# EAGLE design pov_display (EAGLE 6.1)
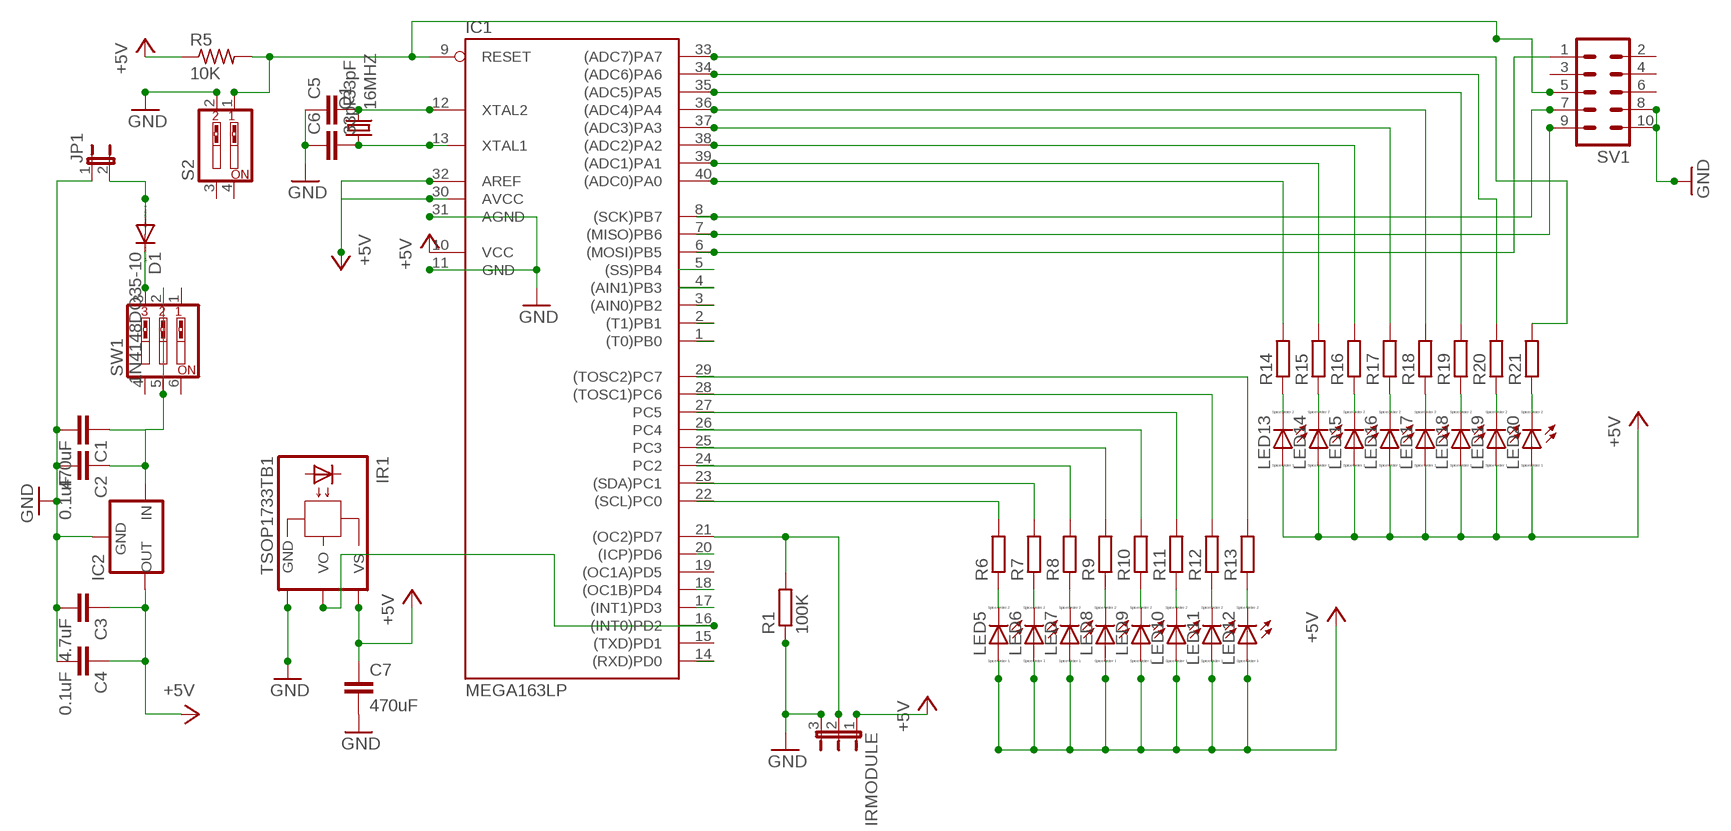
[diagram p0: schematic, sheet 1]

## Parts
C1  470uF  C2.5/4  [C2.5-4]
C2  0.1uF  C2.5/4  [C2.5-4]
C3  4.7uF  C2.5/4  [C2.5-4]
C4  0.1uF  C2.5/4  [C2.5-4]
C5  33pF  C2.5/4  [C2.5-4]
C6  33pF  C2.5/4  [C2.5-4]
C7  470uF  C2.5/4  [C2.5-4]
D1  1N4148DO35-10  [DO35-10]
IC1  MEGA163LP  [DIL40]
IC2  78XXS  [78XXS]
IR1  TSOP1733TB1  [TSOP17_TB1]
IRMODULE  JP2W  [JP2W]
JP1  JP1E  [JP1]
LED5  LED_ELD260  [LED_LD260]
LED6  LED_ELD260  [LED_LD260]
LED7  LED_ELD260  [LED_LD260]
LED8  LED_ELD260  [LED_LD260]
LED9  LED_ELD260  [LED_LD260]
LED10  LED_ELD260  [LED_LD260]
LED11  LED_ELD260  [LED_LD260]
LED12  LED_ELD260  [LED_LD260]
LED13  LED_ELD260  [LED_LD260]
LED14  LED_ELD260  [LED_LD260]
LED15  LED_ELD260  [LED_LD260]
LED16  LED_ELD260  [LED_LD260]
LED17  LED_ELD260  [LED_LD260]
LED18  LED_ELD260  [LED_LD260]
LED19  LED_ELD260  [LED_LD260]
LED20  LED_ELD260  [LED_LD260]
Q1  16MHZ  CRYSTALHC49U-V  [HC49U-V]
R1  100K  R-EU_0207/7  [0207/7]
R5  10K  R-US_0204/7  [0204/7]
R6  R-EU_0207/7  [0207/7]
R7  R-EU_0207/7  [0207/7]
R8  R-EU_0207/7  [0207/7]
R9  R-EU_0207/7  [0207/7]
R10  R-EU_0207/7  [0207/7]
R11  R-EU_0207/7  [0207/7]
R12  R-EU_0207/7  [0207/7]
R13  R-EU_0207/7  [0207/7]
R14  R-EU_0207/7  [0207/7]
R15  R-EU_0207/7  [0207/7]
R16  R-EU_0207/7  [0207/7]
R17  R-EU_0207/7  [0207/7]
R18  R-EU_0207/7  [0207/7]
R19  R-EU_0207/7  [0207/7]
R20  R-EU_0207/7  [0207/7]
R21  R-EU_0207/7  [0207/7]
S2  SW_DIP-2  [EDG-02]
SV1  MA05-2  [MA05-2]
SW1  SW_DIP-3  [EDG-03]

## Nets
+5V: C3.1 C4.1 C7.1 IC1.10(VCC) IC1.30(AVCC) IC1.32(AREF) IC2.OUT IR1.VS IRMODULE.1 LED5.A LED6.A LED7.A LED8.A LED9.A LED10.A LED11.A LED12.A LED13.A LED14.A LED15.A LED16.A LED17.A LED18.A LED19.A LED20.A R5.1
GND: C1.2 C2.2 C3.2 C4.2 C5.1 C6.1 C7.2 IC1.11(GND) IC1.31(AGND) IC2.GND IR1.GND IRMODULE.3 JP1.1 R1.1 S2.2 SV1.8 SV1.10
N$1: D1.A JP1.2
N$2: LED12.K(C) R13.1
N$3: C5.2 IC1.12(XTAL2) Q1.2
N$4: C6.2 IC1.13(XTAL1) Q1.1
N$5: IC1.20((ICP)PD6)
N$6: IC1.9(RESET) R5.2 S2.1 SV1.5
N$7: IC1.22((SCL)PC0) R6.2
N$8: D1.C SW1.3
N$9: C1.1 C2.1 IC2.IN SW1.2 SW1.5
N$10: IC1.1((T0)PB0)
N$11: IC1.2((T1)PB1)
N$12: IC1.3((AIN0)PB2)
N$13: IC1.4((AIN1)PB3)
N$14: IC1.17((INT1)PD3)
N$15: IC1.21((OC2)PD7) IRMODULE.2 R1.2
N$16: IC1.5((SS)PB4)
N$17: IC1.28((TOSC1)PC6) R12.2
N$18: LED10.K(C) R11.1
N$19: IC1.26(PC4) R10.2
N$20: LED9.K(C) R10.1
N$21: IC1.25(PC3) R9.2
N$22: LED8.K(C) R9.1
N$23: LED7.K(C) R8.1
N$24: IC1.6((MOSI)PB5) SV1.1
N$25: IC1.7((MISO)PB6) SV1.9
N$26: IC1.8((SCK)PB7) SV1.7
N$27: IC1.14((RXD)PD0)
N$28: IC1.23((SDA)PC1) R7.2
N$29: IC1.33((ADC7)PA7) R21.2
N$30: IC1.34((ADC6)PA6) R20.2
N$31: IC1.35((ADC5)PA5) R19.2
N$32: IC1.36((ADC4)PA4) R18.2
N$33: IC1.37((ADC3)PA3) R17.2
N$34: IC1.38((ADC2)PA2) R16.2
N$35: IC1.39((ADC1)PA1) R15.2
N$36: IC1.40((ADC0)PA0) R14.2
N$37: IC1.24(PC2) R8.2
N$38: IC1.27(PC5) R11.2
N$39: IC1.29((TOSC2)PC7) R13.2
N$40: LED6.K(C) R7.1
N$41: LED20.K(C) R21.1
N$42: LED19.K(C) R20.1
N$43: LED18.K(C) R19.1
N$44: LED17.K(C) R18.1
N$45: LED15.K(C) R16.1
N$46: LED13.K(C) R14.1
N$47: LED16.K(C) R17.1
N$48: LED14.K(C) R15.1
N$49: LED5.K(C) R6.1
N$50: LED11.K(C) R12.1
N$57: IC1.18((OC1B)PD4)
N$58: IC1.16((INT0)PD2) IR1.VO
Unconnected: IC1.15((TXD)PD1) IC1.19((OC1A)PD5) S2.3 S2.4 SV1.2 SV1.3 SV1.4 SV1.6 SW1.1 SW1.4 SW1.6

## Library data of the parts
C1-C7 = capacitor-wima:C: CAPACITOR naming: grid - package width
D1 = diode:1N4148: DIODE high speed (Philips)
IC1 = atmel:MEGA163*P: MICROCONTROLLER 16 Kbytes FLASH 1 Kbytes EEPROM 1 Kbytes SRAM UART 8-channel 10 bit ADC hardware multiplier Source: avr.lbr; OC_FARNELL: unknown; OC_NEWARK: unknown
IC2 = v-reg:78XXS: VOLTAGE REGULATOR
IR1 = telefunken:TSOP17*TB1: TSOP17..TB1 IR Receiver Modules for Remote Control Systems Source: http://www.vishay.com/docs/82042/82042.pdf; OC_FARNELL: unknown; OC_NEWARK: unknown
IRMODULE = jumper:JP2W: JUMPER
JP1 = jumper:JP1E: JUMPER
LED5-LED20 = eagle-ltspice:LED_E: LED Source: http://www.osram.convergy.de Source: www.luxeon.com Source: www.kingbright.com; SPICEMODEL: NONE; SPICEPREFIX: D; SPICETYPE: diode
Q1 = crystal:CRYSTAL: CRYSTAL; OC_FARNELL: 1666969; OC_NEWARK: unknown
R1 R6-R21 = rcl:R-EU_: RESISTOR, European symbol
R5 = resistor:R-US_: RESISTOR, American symbol
S2 = special:SW_DIP-2: DIP SWITCH
SV1 = con-lstb:MA05-2: PIN HEADER; OC_FARNELL: unknown; OC_NEWARK: unknown
SW1 = special:SW_DIP-3: DIP SWITCH

## Board
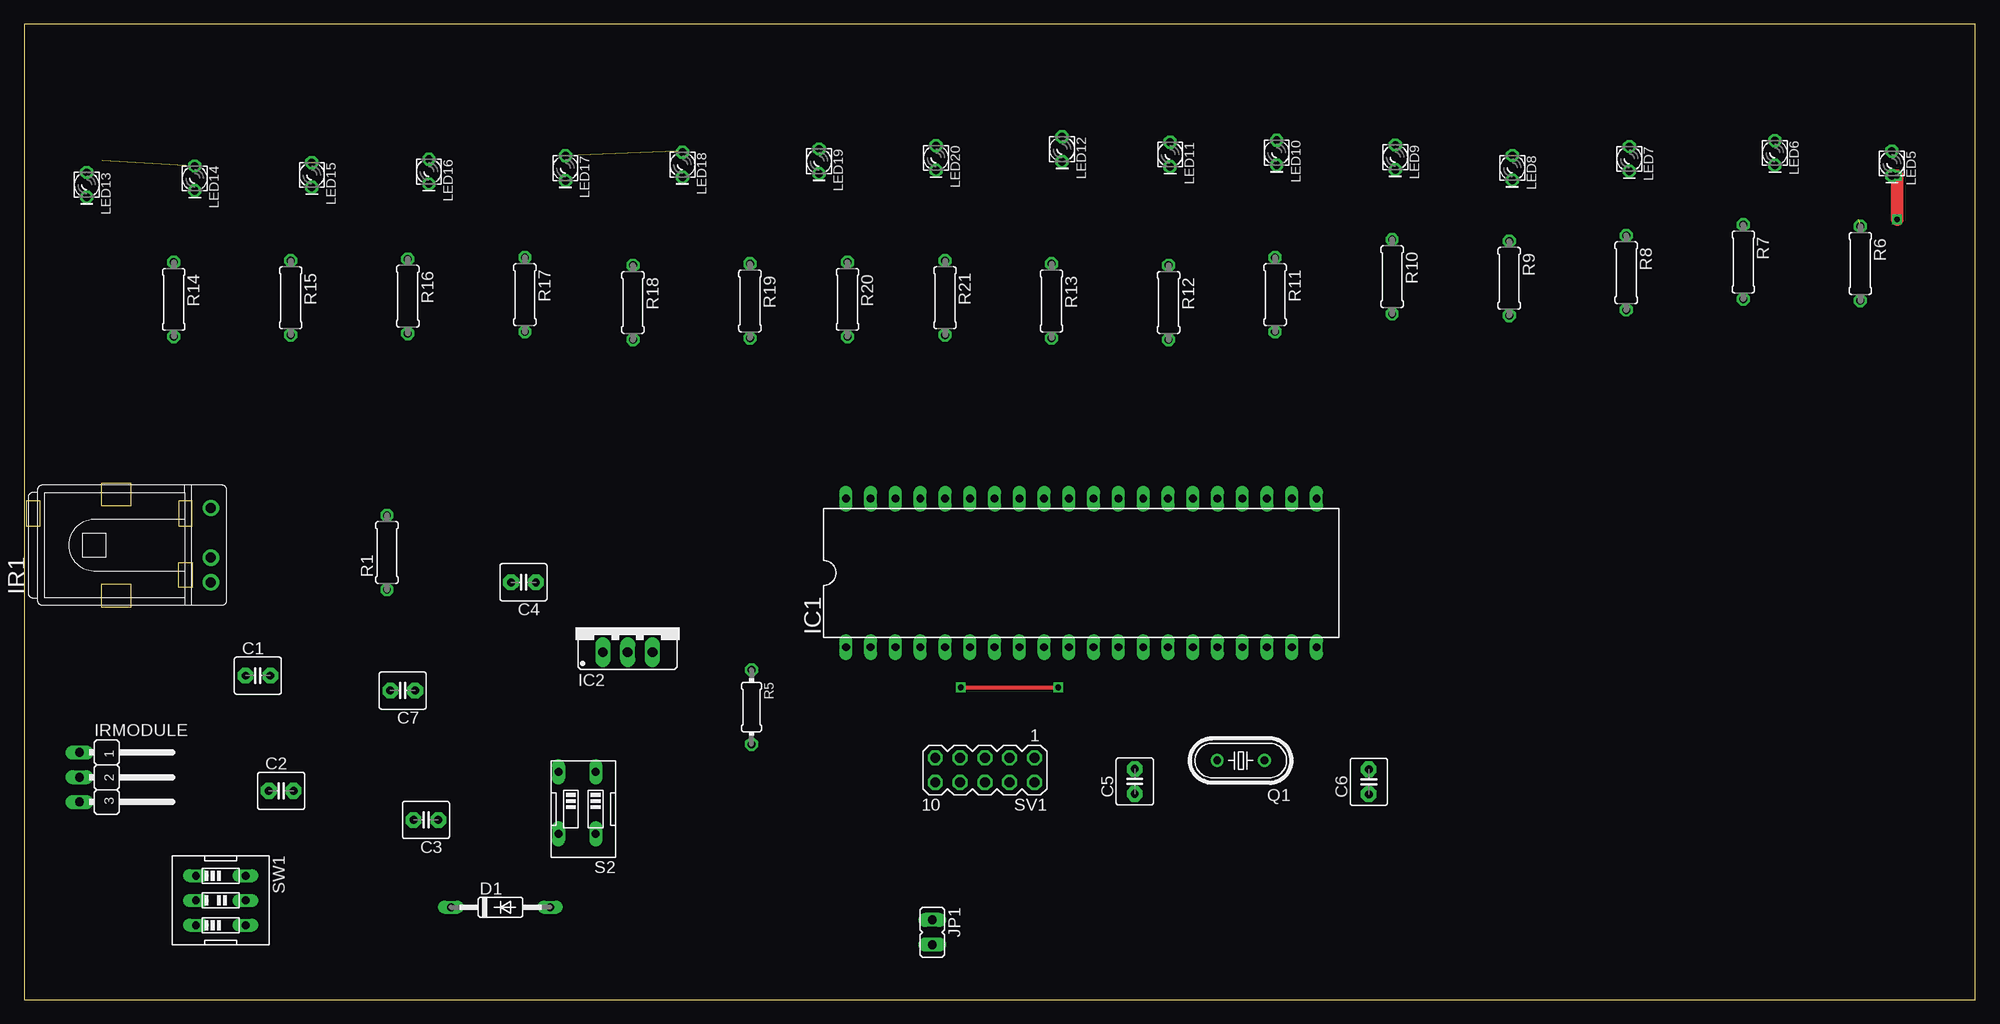
[diagram p1: board, top side]
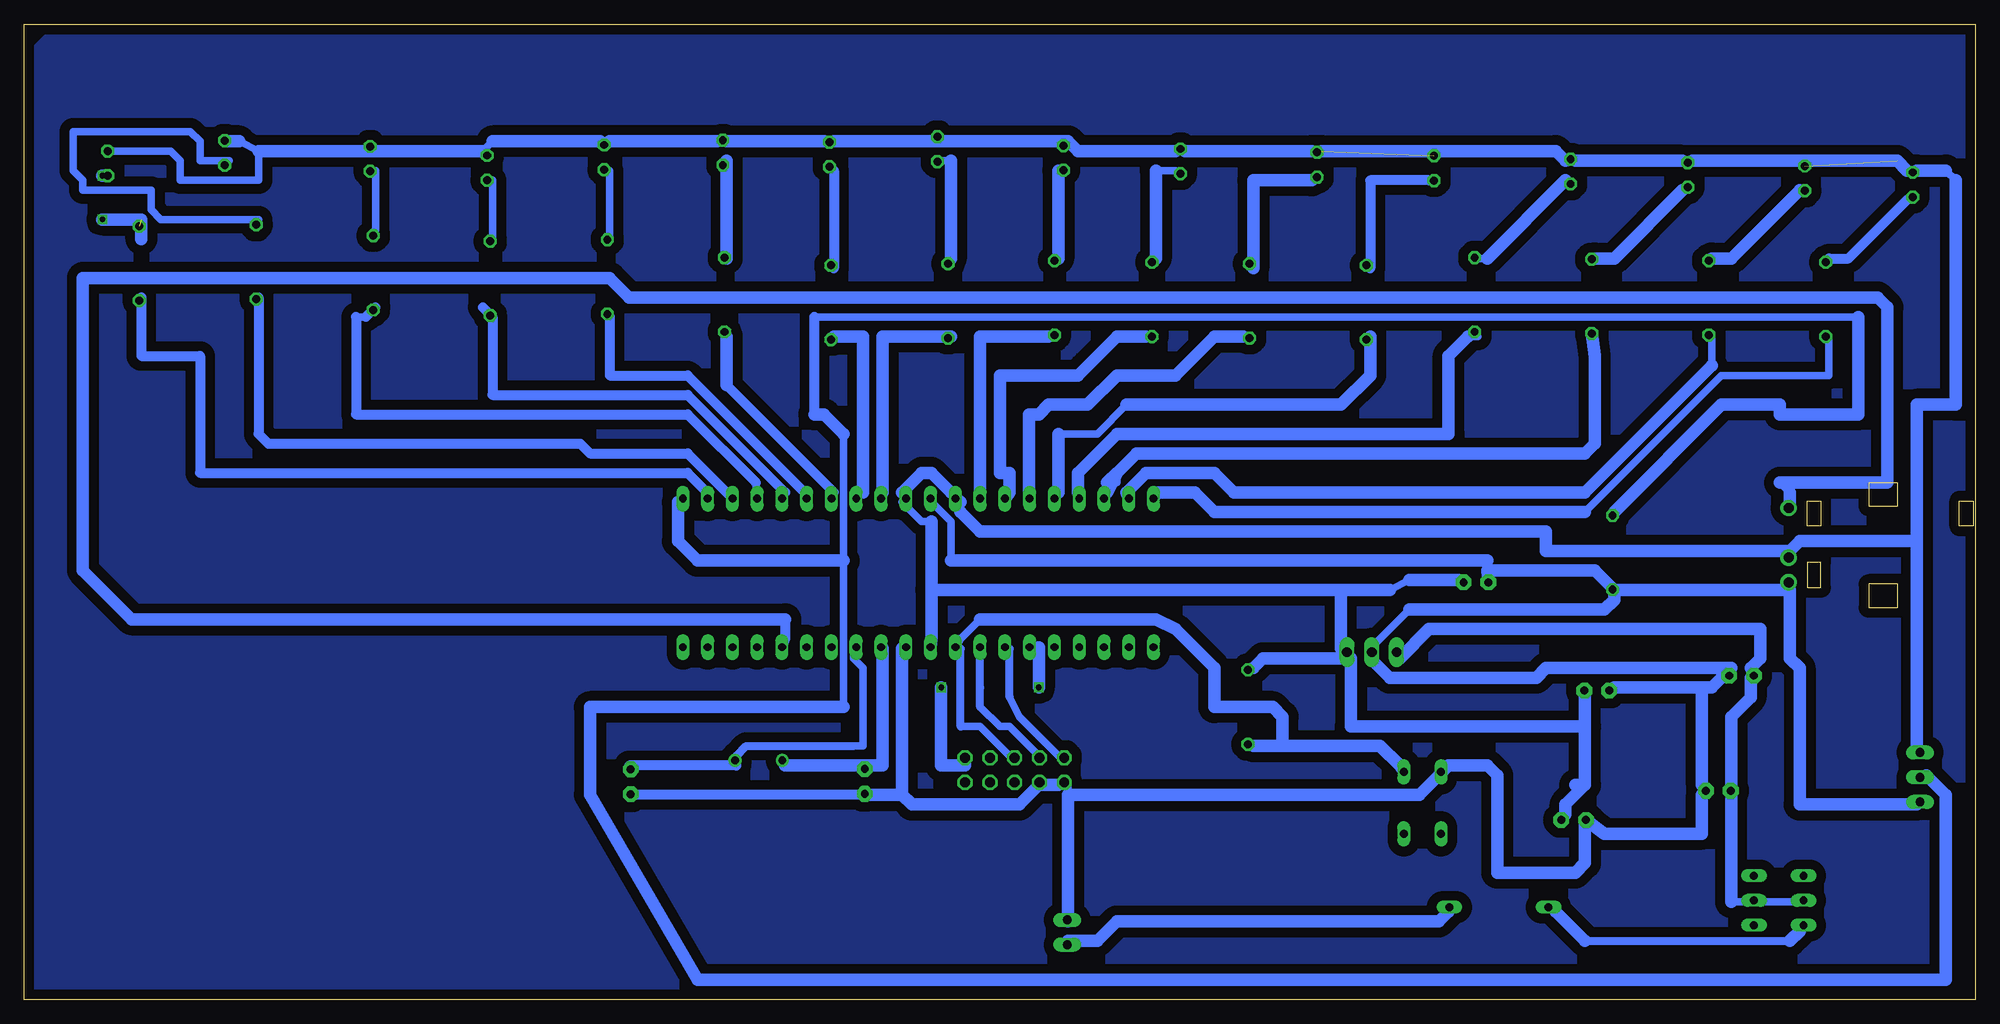
[diagram p2: board, bottom side, seen from below]

Size 200 x 100 mm. Coordinates in mm from the lower left corner, seen from the top.
Outline: 0,0 200,0 200,100 0,100 0,0
Copper layers (1*16): Top 0.035mm / dielectric 1.5mm / Bottom 0.035mm
Design rules "default": minimum track width 30mil, minimum drill 24mil, track to track 8mil, track to pad 8mil, pad to pad 8mil, via to via 8mil, smd to smd 8mil, copper to edge 40mil, drill to drill 8mil, minimum pad ring 10mil, minimum via ring 8mil, stop-mask expansion 4mil, vias tented up to drill 0mil, thermal gap 10mil

### Footprints (pad centres in the part's own frame; a part is rotated, then mirrored left to right if it is on the bottom)
C2.5-4 = drill 0.813 pad 1.6 octagon: 1 -1.27,0; 2 1.27,0
DO35-10 = drill 0.813 long: A 5.08,0; C -5.08,0
DIL40 = drill 0.813 long: 1 -24.13,-7.62; 2 -21.59,-7.62; 3 -19.05,-7.62; 4 -16.51,-7.62; 5 -13.97,-7.62; 6 -11.43,-7.62; 7 -8.89,-7.62; 8 -6.35,-7.62; 9 -3.81,-7.62; 10 -1.27,-7.62; 11 1.27,-7.62; 12 3.81,-7.62; 13 6.35,-7.62; 14 8.89,-7.62; 15 11.43,-7.62; 16 13.97,-7.62; 17 16.51,-7.62; 18 19.05,-7.62; 19 21.59,-7.62; 20 24.13,-7.62; 21 24.13,7.62; 22 21.59,7.62; 23 19.05,7.62; 24 16.51,7.62; 25 13.97,7.62; 26 11.43,7.62; 27 8.89,7.62; 28 6.35,7.62; 29 3.81,7.62; 30 1.27,7.62; 31 -1.27,7.62; 32 -3.81,7.62; 33 -6.35,7.62; 34 -8.89,7.62; 35 -11.43,7.62; 36 -13.97,7.62; 37 -16.51,7.62; 38 -19.05,7.62; 39 -21.59,7.62; 40 -24.13,7.62
78XXS = drill 1.016 long: GND 0,-2.54; IN -2.54,-2.54; OUT 2.54,-2.54
TSOP17_TB1 = drill 1 pad 1.676: GND 0,-3.81; VO 0,3.81; VS 0,-1.27
JP2W = drill 0.914 long: 1 -2.54,-1.27; 2 0,-1.27; 3 2.54,-1.27
JP1 = drill 0.914 long: 1 0,-1.27; 2 0,1.27
LED_LD260 = drill 0.813 octagon: A -1.27,0; K 1.27,0
HC49U-V = drill 0.813: 1 -2.413,0; 2 2.413,0
0207/7 = drill 0.813 octagon: 1 -3.81,0; 2 3.81,0
0204/7 = drill 0.813 octagon: 1 -3.81,0; 2 3.81,0
EDG-02 = drill 0.813 long: 1 -1.27,-3.81; 2 2.54,-3.81; 3 2.54,2.54; 4 -1.27,2.54
MA05-2 = drill 1.016 octagon: 1 -5.08,-1.27; 2 -5.08,1.27; 3 -2.54,-1.27; 4 -2.54,1.27; 5 0,-1.27; 6 0,1.27; 7 2.54,-1.27; 8 2.54,1.27; 9 5.08,-1.27; 10 5.08,1.27
EDG-03 = drill 0.813 long: 1 -2.54,-2.54; 2 0,-2.54; 3 2.54,-2.54; 4 2.54,2.54; 5 0,2.54; 6 -2.54,2.54

### Placement (x,y rotation side)
C1  23.94,33.21 0 top
C2  26.32,21.4 0 top
C3  41.17,18.41 180 top
C4  51.17,42.79 180 top
C5  113.84,22.36 90 top
C6  137.84,22.33 90 top
C7  38.79,31.68 180 top
D1  48.82,9.46 0 top
IC1  108.36,43.75 0 top
IC2  61.85,38.16 0 top
IR1  19.11,46.59 0 top
IRMODULE  6.92,22.79 270 top
JP1  93.08,6.89 180 top
LED5  191.47,85.74 270 top
LED6  179.47,86.82 270 top
LED7  164.55,86.21 270 top
LED8  152.55,85.29 270 top
LED9  140.55,86.37 270 top
LED10  128.39,86.85 270 top
LED11  117.47,86.66 270 top
LED12  106.39,87.2 270 top
LED13  6.39,83.55 270 top
LED14  17.47,84.21 270 top
LED15  29.47,84.56 270 top
LED16  41.47,84.91 270 top
LED17  55.47,85.26 270 top
LED18  67.47,85.61 270 top
LED19  81.47,85.96 270 top
LED20  93.47,86.31 270 top
Q1  124.71,24.51 180 top
R1  37.17,45.84 90 top
R5  74.55,29.99 270 top
R6  188.23,75.48 270 top
R7  176.23,75.64 270 top
R8  164.23,74.53 270 top
R9  152.23,73.96 270 top
R10  140.23,74.12 270 top
R11  128.23,72.28 270 top
R12  117.31,71.48 270 top
R13  105.31,71.64 270 top
R14  15.31,71.8 270 top
R15  27.31,71.96 270 top
R16  39.31,72.12 270 top
R17  51.31,72.28 270 top
R18  62.39,71.48 270 top
R19  74.39,71.64 270 top
R20  84.39,71.8 270 top
R21  94.39,71.96 270 top
S2  57.3,19.53 180 top
SV1  98.47,23.52 180 top
SW1  20.13,10.16 270 top

### Tracks (layer width: path | path; a pad name or v marks a point on that pad's centre or on a via)
+5V  (2 unrouted)
  Bottom 0.762: 107,49 108,49 110,51 IC1.30 110,52 | 105,52 IC1.32 | 40,31 C7.1 40,28 | 42,19 C3.1 | 74,34 R5.1 | 65,35 IC2.OUT | 60,42 58,43 | 53,43 C4.1 | 65,36 IC2.OUT | 64,35 IC2.OUT | 6,26 IRMODULE.1 | 7,85 LED13.A 6,85 | 29,86 LED15.A 30,86 | 41,86 LED16.A | 3,85 2,84 | 178,88 176,87 176,84 184,84 184,86 185,87 191,87 LED5.A | 179,88 LED6.A | 165,87 LED7.A | 68,87 LED18.A 67,87 | 81,87 LED19.A 82,87 | 118,88 LED11.A 117,88 | 128,88 LED10.A 129,88 | 140,88 LED9.A 141,88 | 93,88 LED20.A | 106,88 LED12.A | 152,88 153,87 LED8.A | 104,50 104,51 | 19,46 IR1.VS
  Bottom 1.27: 107,49 107,42 | 107,42 107,37 IC1.10 | 105,52 107,54 108,54 110,52 | 40,22 40,28 | 40,28 40,31 | 42,19 42,20 40,22 | 40,22 41,22 | 74,34 73,35 65,35 | 58,43 53,43 | 65,36 65,42 | 65,42 60,42 | 40,28 64,28 64,35 | 65,42 107,42 | 6,47 6,26 | 6,47 18,47 19,46 44,46 44,48 102,48 104,50 | 7,85 8,86 29,86 | 30,86 41,86 | 6,47 6,61 2,61 2,84 | 6,85 3,85 | 153,87 165,87 176,87 | 178,88 179,88 | 81,87 68,87 | 82,87 92,87 93,88 106,88 117,88 | 128,88 118,88 | 129,88 140,88 | 141,88 152,88 | 67,87 43,87 42,86 LED16.A | 104,51 IC1.32
GND
  Bottom 0.762: 6,20 IRMODULE.3 | 105,45 105,49 107,51 IC1.31 | 50,45 C4.2 | 58,40 62,36 IC2.GND 62,35 | 19,42 IR1.GND | 37,42 R1.1 | 26,33 C1.2 25,34 | 37,32 C7.2 | 40,18 C3.2 | 28,21 C2.2 28,22 | 93,21 93,22 SV1.10 94,22 | 93,8 JP1.1 | 110,36 IC1.11 | 138,21 C6.1 | 114,21 C5.1 | 96,22 SV1.8 | 55,23 S2.2
  Bottom 1.016: 114,21 138,21
  Bottom 1.27: 6,20 18,20 18,34 19,35 19,42 37,42 | 37,42 39,44 50,44 C4.2 | 50,45 105,45 | 37,42 37,41 38,40 58,40 | 26,33 27,32 28,32 | 37,32 28,32 | 40,18 40,14 41,13 49,13 49,23 50,24 54,24 55,23 57,21 93,21 93,8 | 28,21 28,17 38,17 C3.2 | 28,22 28,32 | 94,22 96,22 98,20 109,20 110,21 | 110,21 110,36 | 114,21 110,21 | 62,35 60,33 45,33 44,34 25,34
N$1
  Bottom 0.762: 54,9 D1.A | 93,6 JP1.2
  Bottom 1.27: 54,9 55,8 88,8 90,6 93,6
N$2
  Bottom 0.762: 105,86 106,86 LED12.K | 105,76 R13.1
  Bottom 1.27: 105,86 105,76
N$3
  Bottom 0.762: 122,24 Q1.2 | 112,36 IC1.12 | 114,24 C5.2
  Bottom 1.27: 122,24 114,24 112,24 112,36
N$4
  Bottom 0.762: 115,26 114,26 114,34 115,35 115,36 IC1.13 | 127,25 Q1.1 127,24 | 138,24 C6.2
  Bottom 0.813: 115,26 126,26 127,25
  Bottom 1.016: 127,24 138,24
N$6
  Bottom 0.762: 104,28 102,28 99,25 SV1.5 | 104,36 IC1.9 104,37 102,39 | 74,26 R5.2
  Bottom 0.813: 104,28 104,36
  Bottom 1.27: 74,26 71,26 | 71,26 61,26 59,24 S2.1 | 102,39 84,39 82,38 78,34 78,30 72,30 71,29 71,26
N$7
  Bottom 0.762: 130,52 IC1.22 | 188,72 R6.2
  Bottom 1.016: 130,52 132,54 182,54 182,66 188,66 188,72
N$8
  Bottom 0.762: 18,7 SW1.3 | 43,9 D1.C
  Bottom 0.813: 40,6 19,6
  Bottom 1.27: 19,6 18,7 | 43,9 40,6
N$9
  Bottom 0.762: SW1.2 18,10 22,10 SW1.5 23,10 25,10 | 25,21 C2.1 25,22 | 23,34 C1.1 23,33
  Bottom 1.27: 25,10 25,21 | 23,34 22,35 22,38 24,38 56,38 59,35 IC2.IN | 25,22 25,29 23,31 23,33
N$15
  Bottom 0.762: 119,70 12,70 | 116,58 116,45 116,30 | 37,50 R1.2 | 133,51 IC1.21 | 5,23 IRMODULE.2
  Bottom 1.016: 119,60 119,70
  Bottom 1.27: 37,50 26,61 20,61 20,60 12,60 12,70 | 116,58 118,60 119,60 | 116,45 131,45 133,47 133,51 | 5,23 3,21 3,2 131,2 142,21 142,30 116,30
N$17
  Bottom 0.762: 114,52 115,51 115,52 IC1.28 | 117,68 R12.2
  Bottom 1.27: 114,52 114,68 117,68
N$18
  Bottom 0.762: 128,76 R11.1 | 128,86 LED10.K
  Bottom 1.27: 128,86 128,76
N$19
  Bottom 1.016: IC1.26 120,52 132,64 140,64 140,70 R10.2
N$20
  Bottom 0.762: R10.1 140,78 140,85 LED9.K
N$21
  Bottom 0.762: 122,52 IC1.25 | 152,70 R9.2
  Bottom 1.016: 122,52 132,62 152,62 152,70 153,71
N$22
  Bottom 0.762: R9.1 152,78 152,84 LED8.K
N$23
  Bottom 0.762: R8.1 164,79 164,85 LED7.K
N$24  (via drill 0.6)
  Top 0.406: v96,32 v106,32
  Bottom 1.27: IC1.6 96,36.13 v96,32 | v106,32 106,24 103.55,24 SV1.1
N$25
  Bottom 0.762: 99,31 98,29 94,25 SV1.9
  Bottom 0.813: 99,31 99,36 IC1.7
N$26
  Bottom 0.762: 102,30 100,28 99,28 96,25 SV1.7 | 102,36 IC1.8
  Bottom 0.813: 102,36 102,32 102,30
N$28
  Bottom 0.762: 176,72 R7.2
  Bottom 1.016: 176,72 176,58 175,57 143,57 142,56 132,56 128,52 IC1.23
N$29
  Bottom 0.762: 102,52 IC1.33 | 95,68 R21.2
  Bottom 1.27: 102,52 102,68 95,68
N$30
  Bottom 0.762: 85,68 R20.2
  Bottom 1.27: 85,68 88,68 92,64 100,64 100,54 99,54 99,52 IC1.34
N$31
  Bottom 0.762: 75,68 R19.2 | 97,52 IC1.35
  Bottom 1.27: 75,68 78,68 82,64 88,64 91,61 95,61 96,60 97,60 97,52
N$32
  Bottom 0.762: 94,58 90,58 87,61 | 62,68 R18.2 | 94,52 IC1.36
  Bottom 1.27: 62,68 62,64 65,61 87,61 | 94,52 94,58
N$33
  Bottom 0.762: 52,68 51,68 R17.2 | 92,52 IC1.37
  Bottom 1.27: 52,68 54,66 54,58 88,58 92,54 92,52
N$34
  Bottom 0.762: 89,53 88,53 88,54 | 89,52 IC1.38
  Bottom 1.27: 89,53 88,54 | 88,54 86,56 40,56 39,57 39,66 R16.2 | 89,52 88,54
N$35
  Bottom 0.762: 27,65 27,68 R15.2
  Bottom 1.27: 27,65 40,52 76,52 78,54 85,54 87,52 IC1.39
N$36
  Bottom 0.762: 40,50 26,64 15,64 15,68 R14.2
  Bottom 1.27: 40,50 78,50 80,52 84,52 IC1.40
N$37
  Bottom 0.762: 125,53 125,52 | 165,70 166,70 | 164,71 R8.2
  Bottom 1.016: 125,53 132,60 166,60 166,70 | 164,71 165,70 | 125,52 IC1.24
N$38
  Bottom 0.762: 117,52 IC1.27 | 128,68 R11.2
  Bottom 1.016: 128,63 117,52
  Bottom 1.27: 128,68 128,63
N$39
  Bottom 0.762: 112,52 IC1.29 | 105,68 R13.2
  Bottom 1.27: 112,52 112,68 105,68
N$40
  Bottom 0.762: R7.1 176,80 186,80 187,81 187,83 194,83 194,84 195,85 195,89 183,89 182,88 182,86 179,86 LED6.K
N$41
  Bottom 0.762: 94,76 R21.1 | 94,85 LED20.K
  Bottom 1.27: 94,85 94,76
N$42
  Bottom 0.762: 84,85 82,85 LED19.K | 84,76 R20.1
  Bottom 1.27: 84,85 84,76
N$43
  Bottom 0.762: 74,75 R19.1 | 68,84 LED18.K
  Bottom 1.27: 74,75 74,84 68,84
N$44
  Bottom 0.762: 62,75 R18.1
  Bottom 1.016: 62,75 62,84 56,84 LED17.K
N$45
  Bottom 0.762: 30,83 LED15.K | 39,76 R16.1
  Bottom 1.27: 30,83 37,76 39,76
N$46
  Bottom 0.762: 7,82 LED13.K | 15,76 R14.1
  Bottom 1.016: 7,82 13,76 15,76
N$47
  Bottom 0.762: 50,76 51,76 R17.1 | 42,84 LED16.K
  Bottom 1.27: 50,76 42,84
N$48
  Bottom 0.762: 18,83 LED14.K
  Bottom 1.27: 18,83 25,76 27,76 R15.1
N$49  (via drill 0.6)  (1 unrouted)
  Top 1.27: v192,84.47 v192,80
  Bottom 1.27: LED5.K v192,84.47 | v192,80 188,80 188,78
N$50
  Bottom 0.762: 117,75 R12.1 | 117,85 LED11.K
  Bottom 1.016: 117,85 117,75
N$51
  pour Bottom (isolate 1.016): 4,0 0,4 0,98 2,100 196,100 200,96 200,2 198,0
N$58
  Bottom 0.762: 19,52 20,53
  Bottom 1.016: 122,39 122,37 IC1.16
  Bottom 1.27: 122,39 189,39 194,44 194,74 140,74 138,72 10,72 9,71 9,53 20,53 | 19,52 19,51 IR1.VO